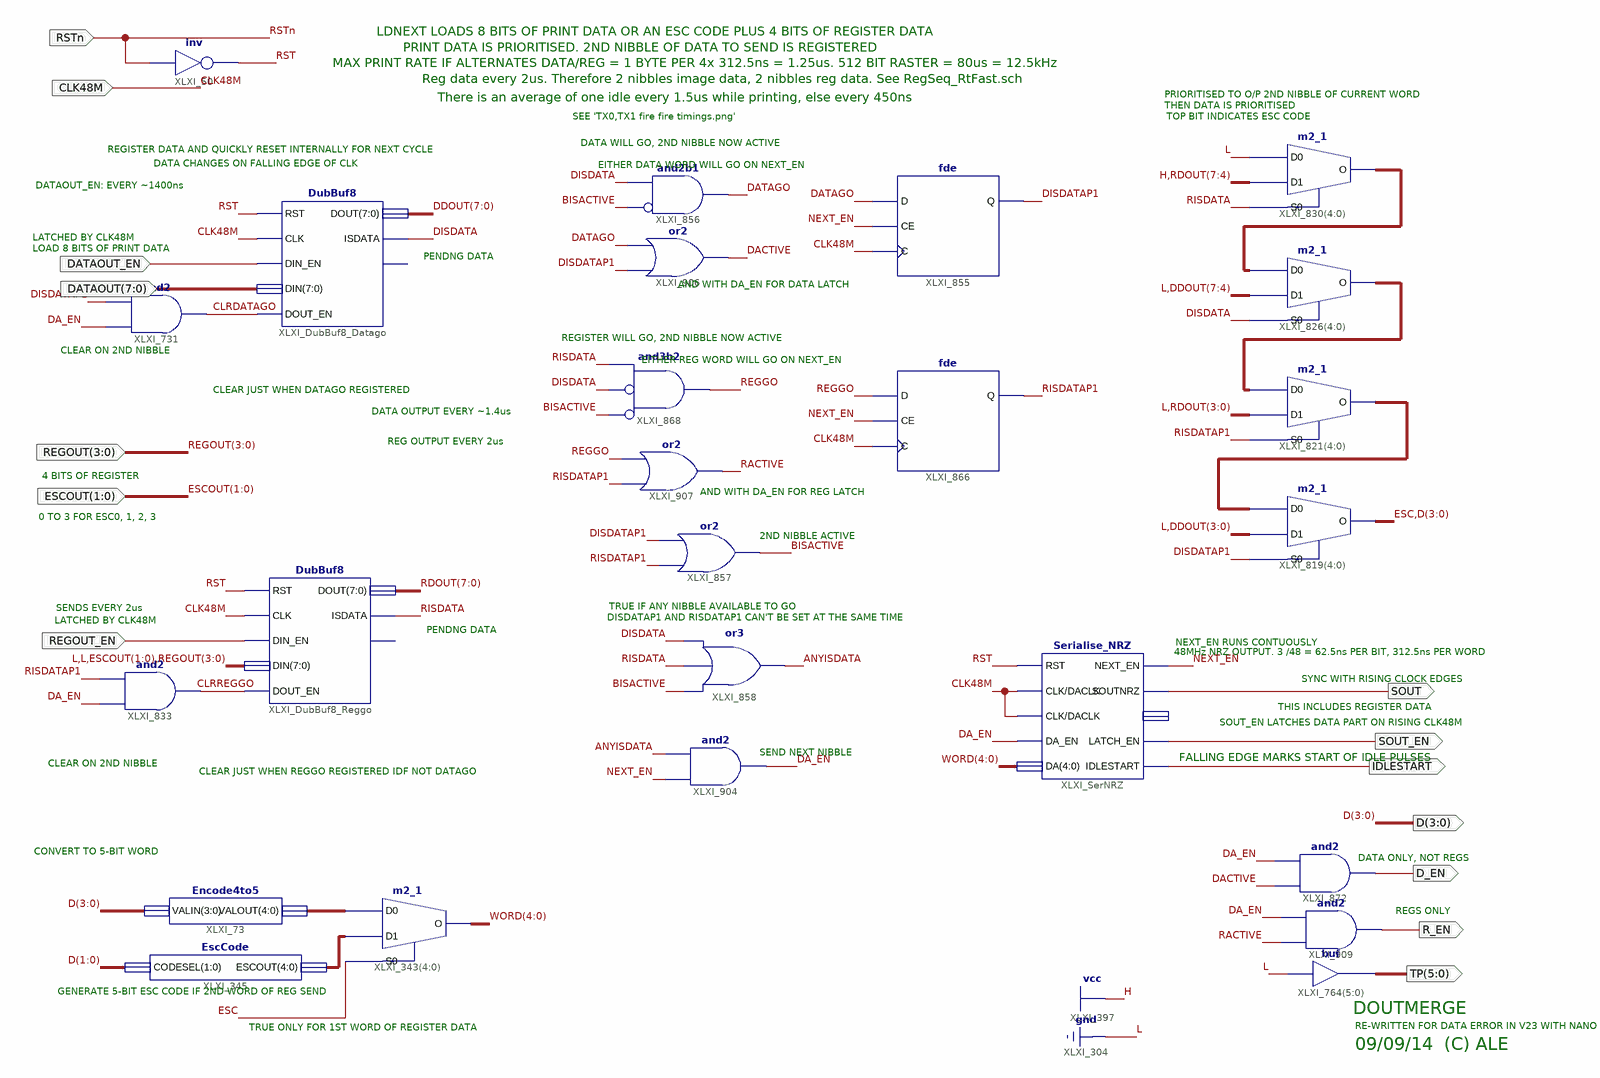
[diagram p0: schematic sheet 1]
// Xilinx ISE schematic DoutMerge.sch (spartan6) as structural Verilog: 25 symbols, 14 ports
module DoutMerge (
  input  CLK48M,
  input  RSTn,
  input  [1:0] ESCOUT,
  input  [3:0] REGOUT,
  input  DATAOUT_EN,
  input  [7:0] DATAOUT,
  input  REGOUT_EN,
  output [3:0] D,
  output [5:0] TP,
  output SOUT,
  output SOUT_EN,
  output D_EN,
  output R_EN,
  output IDLESTART
);

  wire ANYISDATA, BISACTIVE, CLRDATAGO, CLRREGGO, DA_EN, DACTIVE, DATAGO, DISDATA, DISDATAP1, ESC, NEXT_EN,
       RACTIVE, REGGO, RISDATA, RISDATAP1, RST;
  wire [4:0] WORD, XLXN_881, XLXN_887, XLXN_1940, XLXN_1957, XLXN_1973;
  wire [7:0] DDOUT, RDOUT;

  not XLXI_50 (RST, RSTn);
  assign TP = {6{1'b0}};  // buf XLXI_764[5..0], 6 bits wide
  m2_1 XLXI_343[4:0] (.D0(XLXN_881), .D1(XLXN_887), .S0(ESC), .O(WORD));
  EscCode XLXI_345 (.CODESEL(D[1:0]), .ESCOUT(XLXN_887));
  Encode4to5 XLXI_73 (.VALIN(D), .VALOUT(XLXN_881));
  and XLXI_856 (DATAGO, ~BISACTIVE, DISDATA);  // and2b1
  or XLXI_857 (BISACTIVE, RISDATAP1, DISDATAP1);
  or XLXI_858 (ANYISDATA, BISACTIVE, RISDATA, DISDATA);
  Serialise_NRZ XLXI_SerNRZ (
    .CLK(CLK48M), .DA(WORD), .DACLK(CLK48M), .DA_EN(DA_EN), .IDLESTART(IDLESTART), .LATCH_EN(SOUT_EN),
    .NEXT_EN(NEXT_EN), .RST(RST), .SOUTNRZ(SOUT));  // open: CNTBIT
  m2_1 XLXI_821[4:0] (.D0(XLXN_1957), .D1({1'b0, RDOUT[3:0]}), .S0(RISDATAP1), .O(XLXN_1940));
  m2_1 XLXI_826[4:0] (.D0(XLXN_1973), .D1({1'b0, DDOUT[7:4]}), .S0(DISDATA), .O(XLXN_1957));
  m2_1 XLXI_819[4:0] (.D0(XLXN_1940), .D1({1'b0, DDOUT[3:0]}), .S0(DISDATAP1), .O({ESC, D}));
  m2_1 XLXI_830[4:0] (.D0(1'b0), .D1({1'b1, RDOUT[7:4]}), .S0(RISDATA), .O(XLXN_1973));
  fde XLXI_855 (.C(CLK48M), .CE(NEXT_EN), .D(DATAGO), .Q(DISDATAP1));
  and XLXI_868 (REGGO, ~BISACTIVE, ~DISDATA, RISDATA);  // and3b2
  fde XLXI_866 (.C(CLK48M), .CE(NEXT_EN), .D(REGGO), .Q(RISDATAP1));
  and XLXI_904 (DA_EN, NEXT_EN, ANYISDATA);
  or XLXI_906 (DACTIVE, DISDATAP1, DATAGO);
  or XLXI_907 (RACTIVE, RISDATAP1, REGGO);
  and XLXI_872 (D_EN, DACTIVE, DA_EN);
  and XLXI_909 (R_EN, RACTIVE, DA_EN);
  and XLXI_731 (CLRDATAGO, DA_EN, DISDATAP1);
  DubBuf8 XLXI_DubBuf8_Datago (
    .CLK(CLK48M), .DIN(DATAOUT), .DIN_EN(DATAOUT_EN), .DOUT(DDOUT), .DOUT_EN(CLRDATAGO), .ISDATA(DISDATA),
    .RST(RST));  // open: OVERFLOW
  DubBuf8 XLXI_DubBuf8_Reggo (
    .CLK(CLK48M), .DIN({2'b00, ESCOUT, REGOUT}), .DIN_EN(REGOUT_EN), .DOUT(RDOUT), .DOUT_EN(CLRREGGO),
    .ISDATA(RISDATA), .RST(RST));  // open: OVERFLOW
  and XLXI_833 (CLRREGGO, DA_EN, RISDATAP1);

  // Notes on the sheet:
  //   LDNEXT LOADS 8 BITS OF PRINT DATA OR AN ESC CODE PLUS 4 BITS OF REGISTER DATA
  //   PRINT DATA IS PRIORITISED. 2ND NIBBLE OF DATA TO SEND IS REGISTERED
  //   MAX PRINT RATE IF ALTERNATES DATA/REG = 1 BYTE PER 4x 312.5ns = 1.25us. 512 BIT RASTER = 80us = 12.5kHz
  //   Reg data every 2us. Therefore 2 nibbles image data, 2 nibbles reg data. See RegSeq_RtFast.sch
  //   PRIORITISED TO O/P 2ND NIBBLE OF CURRENT WORD
  //   There is an average of one idle every 1.5us while printing, else every 450ns
  //   THEN DATA IS PRIORITISED
  //   SEE 'TX0,TX1 fire fire timings.png'
  //   TOP BIT INDICATES ESC CODE
  //   DATA WILL GO, 2ND NIBBLE NOW ACTIVE
  //   REGISTER DATA AND QUICKLY RESET INTERNALLY FOR NEXT CYCLE
  //   DATA CHANGES ON FALLING EDGE OF CLK
  //   EITHER DATA WORD WILL GO ON NEXT_EN
  //   DATAOUT_EN: EVERY ~1400ns
  //   LATCHED BY CLK48M
  //   LOAD 8 BITS OF PRINT DATA
  //   PENDNG DATA
  //   AND WITH DA_EN FOR DATA LATCH
  //   REGISTER WILL GO, 2ND NIBBLE NOW ACTIVE
  //   CLEAR ON 2ND NIBBLE
  //   EITHER REG WORD WILL GO ON NEXT_EN
  //   CLEAR JUST WHEN DATAGO REGISTERED
  //   DATA OUTPUT EVERY ~1.4us
  //   REG OUTPUT EVERY 2us
  //   4 BITS OF REGISTER
  //   AND WITH DA_EN FOR REG LATCH
  //   0 TO 3 FOR ESC0, 1, 2, 3
  //   2ND NIBBLE ACTIVE
  //   TRUE IF ANY NIBBLE AVAILABLE TO GO
  //   SENDS EVERY 2us
  //   DISDATAP1 AND RISDATAP1 CAN'T BE SET AT THE SAME TIME
  //   LATCHED BY CLK48M
  //   PENDNG DATA
  //   NEXT_EN RUNS CONTUOUSLY
  //   48MHz NRZ OUTPUT. 3 /48 = 62.5ns PER BIT, 312.5ns PER WORD
  //   SYNC WITH RISING CLOCK EDGES
  //   THIS INCLUDES REGISTER DATA
  //   SOUT_EN LATCHES DATA PART ON RISING CLK48M
  //   SEND NEXT NIBBLE
  //   FALLING EDGE MARKS START OF IDLE PULSES
  //   CLEAR ON 2ND NIBBLE
  //   CLEAR JUST WHEN REGGO REGISTERED IDF NOT DATAGO
  //   CONVERT TO 5-BIT WORD
  //   DATA ONLY, NOT REGS
  //   REGS ONLY
  //   GENERATE 5-BIT ESC CODE IF 2ND WORD OF REG SEND
  //   DOUTMERGE
  //   RE-WRITTEN FOR DATA ERROR IN V23 WITH NANO
  //   TRUE ONLY FOR 1ST WORD OF REGISTER DATA
  //   09/09/14  (C) ALE
endmodule
